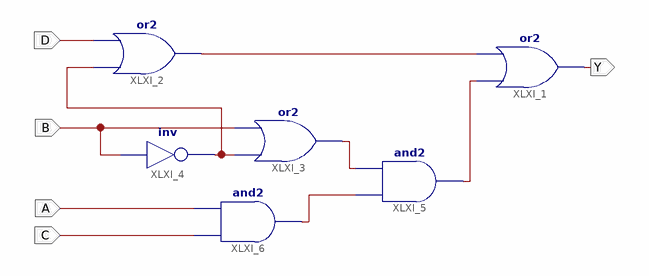
[diagram p0: schematic sheet 1]
// Xilinx ISE schematic scheme.sch (artix7) as structural Verilog: 6 symbols, 5 ports
module scheme (
  input  A,
  input  B,
  input  C,
  input  D,
  output Y
);

  wire XLXN_1, XLXN_2, XLXN_3, XLXN_4, XLXN_5;

  or XLXI_1 (Y, XLXN_3, XLXN_1);
  or XLXI_2 (XLXN_1, XLXN_5, D);
  or XLXI_3 (XLXN_2, XLXN_5, B);
  not XLXI_4 (XLXN_5, B);
  and XLXI_5 (XLXN_3, XLXN_4, XLXN_2);
  and XLXI_6 (XLXN_4, C, A);
endmodule
